# EAGLE design OSSC_HDMI_Audio_v1.3_A3 (EAGLE 7.7.0)
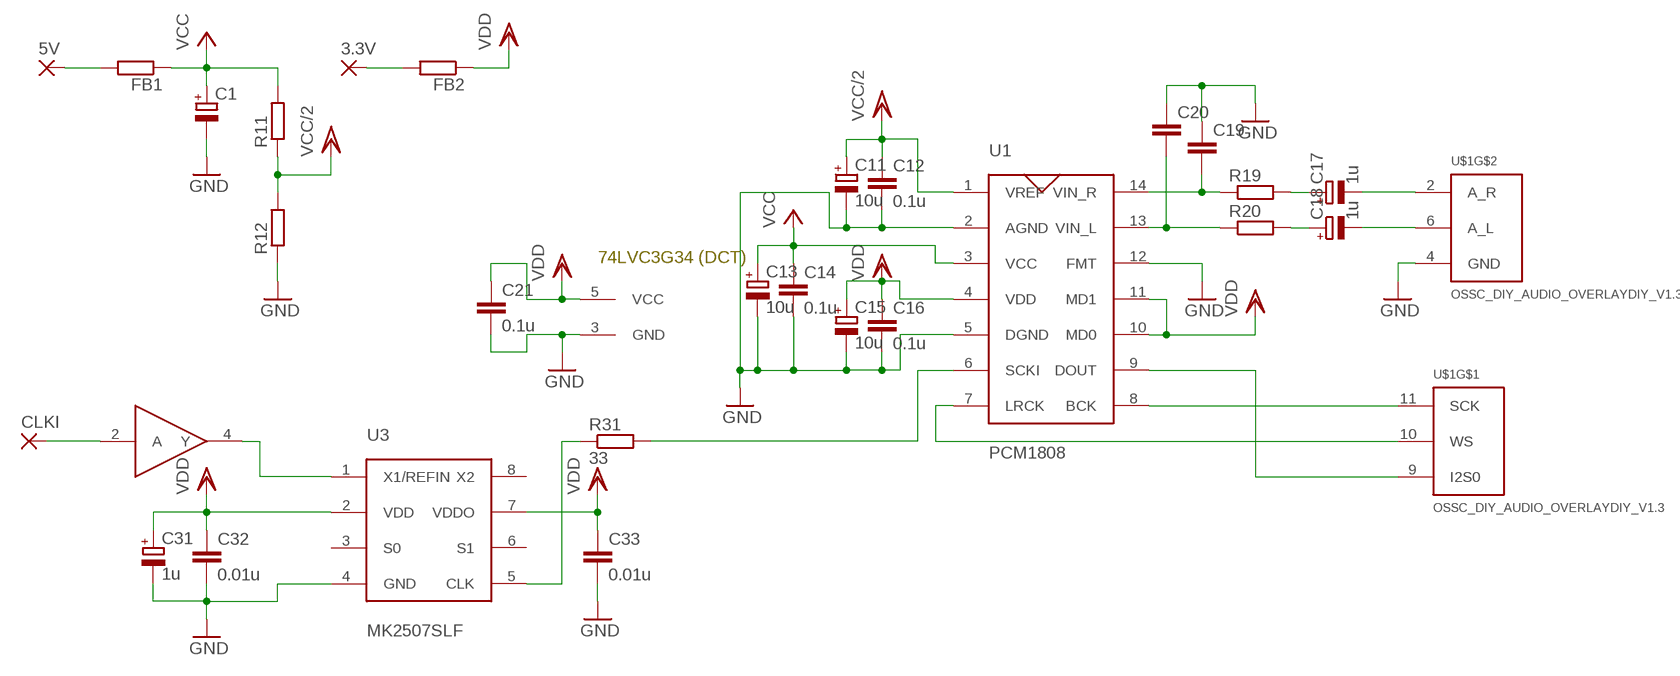
[diagram p0: schematic, sheet 1]

## Parts
3.3V  SMD2  [SMD1,27-2,54]
5V  SMD2  [SMD1,27-2,54]
C1  CPOL-EUSMCC  [SMC_C]
C11  10u  CPOL-EUSMCA  [SMC_A]
C12  0.1u  C-EUC0603  [C0603]
C13  10u  CPOL-EUSMCA  [SMC_A]
C14  0.1u  C-EUC0603  [C0603]
C15  10u  CPOL-EUSMCA  [SMC_A]
C16  0.1u  C-EUC0603  [C0603]
C17  1u  CPOL-EUSMCA  [SMC_A]
C18  1u  CPOL-EUSMCA  [SMC_A]
C19  C-EUC0603  [C0603]
C20  C-EUC0603  [C0603]
C21  0.1u  C-EUC0603  [C0603]
C31  1u  CPOL-EUSMCA  [SMC_A]
C32  0.01u  C-EUC0603  [C0603]
C33  0.01u  C-EUC0603  [C0603]
CLKI  SMD2  [SMD1,27-2,54]
FB1  R-EU_R0603  [R0603]
FB2  R-EU_R0603  [R0603]
R11  R-EU_R0603  [R0603]
R12  R-EU_R0603  [R0603]
R19  R-EU_R0603  [R0603]
R20  R-EU_R0603  [R0603]
R31  33  R-EU_R0603  [R0603]
U1  PCM1808  [PCM1808]
U2  74LVC1G34  [74LVC1G34DCK]
U3  MK2507SLF  [SOIC8]
U$1  OSSC_DIY_AUDIO_OVERLAYDIY_V1.3  [OSSC_OVERLAY_V1.3]

## Nets
GND: C1.- C11.- C12.2 C13.- C14.2 C15.- C16.2 C19.1 C20.1 C21.2 C31.- C32.2 C33.2 R12.1 U1.2(AGND) U1.5(DGND) U1.12(FMT) U2.3(GND) U3.4(GND) U$1.4(GND)
N$1: C18.- U$1.6(A_L)
N$2: C17.- U$1.2(A_R)
N$3: C17.+ R19.2
N$4: C19.2 R19.1 U1.14(VIN_R)
N$5: C20.2 R20.1 U1.13(VIN_L)
N$6: C18.+ R20.2
N$7: R31.1 U3.5(CLK)
N$8: U2.4(Y) U3.1(X1/REFIN)
N$9: CLKI.1(P) U2.2(A)
N$10: 5V.1(P) FB1.2
N$11: 3.3V.1(P) FB2.2
N$13: U1.7(LRCK) U$1.10(WS)
N$14: U1.8(BCK) U$1.11(SCK)
N$15: U1.9(DOUT) U$1.9(I2S0)
N$17: R31.2 U1.6(SCKI)
VCC: C1.+ C13.+ C14.1 FB1.1 R11.2 U1.3(VCC)
VCC/2: C11.+ C12.1 R11.1 R12.2 U1.1(VREF)
VDD: C15.+ C16.1 C21.1 C31.+ C32.1 C33.1 FB2.1 U1.4(VDD) U1.10(MD0) U1.11(MD1) U2.5(VCC) U3.2(VDD) U3.7(VDDO)
Unconnected: U3.3(S0) U3.6(S1) U3.8(X2)

## Notes on the sheet
- 74LVC3G34 (DCT)

## Library data of the parts
3.3V 5V CLKI = wirepad:SMD2: SMD PAD
C1 C11 C13 C15 C17 C18 C31 = rcl:CPOL-EU: POLARIZED CAPACITOR, European symbol
C12 C14 C16 C19-C21 C32 C33 = rcl:C-EU: CAPACITOR, European symbol
FB1 FB2 R11 R12 R19 R20 R31 = rcl:R-EU_: RESISTOR, European symbol
U1 = OSSC_HDMI_Audio:PCM1808
U2 = OSSC_HDMI_Audio:74LVC1G34
U3 = OSSC_HDMI_Audio:MK2507SLF
U$1 = OSSC_HDMI_Audio:OSSC_DIY_AUDIO_OVERLAY

## Board
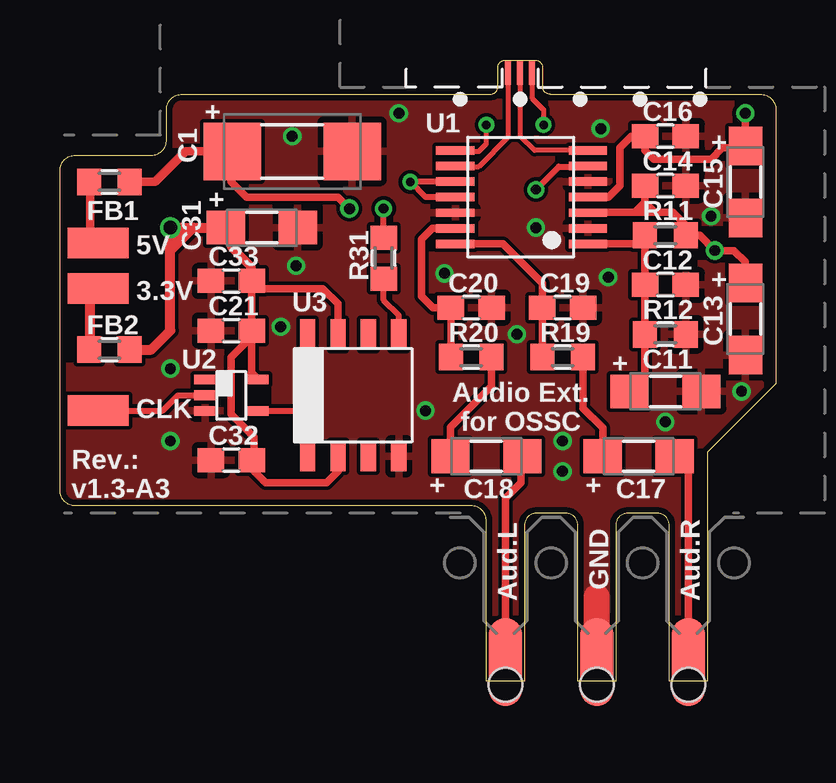
[diagram p1: board, top side]
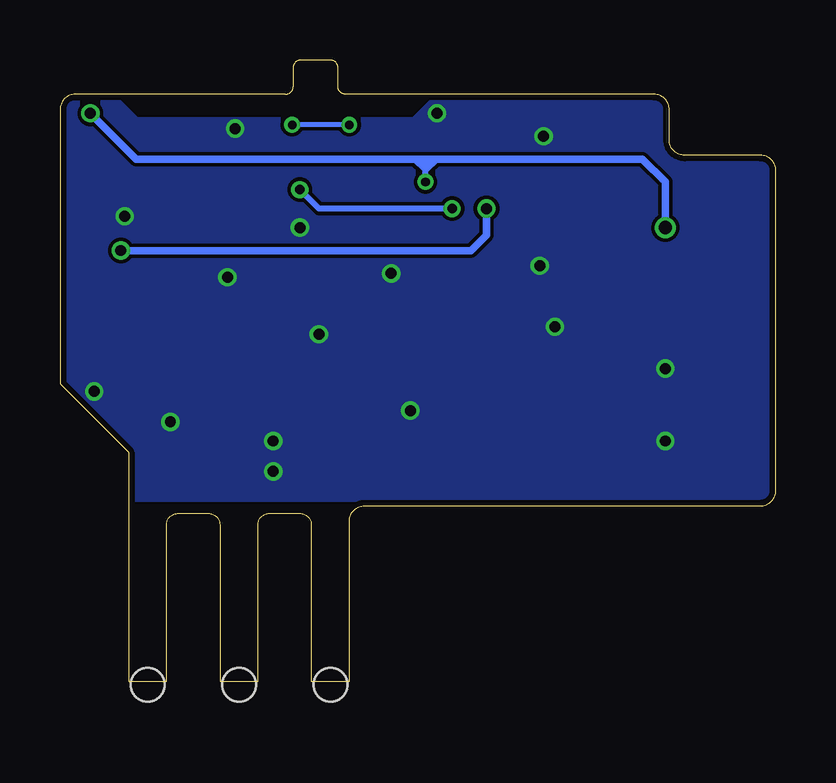
[diagram p2: board, bottom side, seen from below]

Size 29.84 x 25.88 mm. Coordinates in mm from the lower left corner, seen from the top.
Outline: 0,7.94 0,21.27 arc-90 0.64,21.91 3.81,21.91 arc90 4.45,22.54 4.45,23.81 arc-90 5.08,24.45 17.94,24.45 arc90 18.26,24.77 18.26,25.56 arc-90 18.57,25.88 19.8,25.88 arc-90 20.12,25.56 20.12,24.77 arc90 20.44,24.45 29.21,24.45 arc-90 29.84,23.81 29.84,12.38 26.99,9.53 26.99,0 25.4,0 25.4,6.51 arc90 24.92,6.99 23.65,6.99 arc90 23.18,6.51 23.18,0 21.59,0 21.59,6.51 arc90 21.11,6.99 19.84,6.99 arc90 19.37,6.51 19.37,0 17.78,0 17.78,6.67 arc90 17.14,7.3 0.64,7.3 arc-90 0,7.94
Copper layers (1*16): Top 0.035mm / dielectric 1.5mm / Bottom 0.035mm
Design rules "ITEADstudio_DRC": minimum track width 6mil, minimum drill 12mil, track to track 6mil, track to pad 6mil, pad to pad 6mil, via to via 6mil, smd to smd 0mil, copper to edge 10mil, drill to drill 10mil, minimum pad ring 10mil, minimum via ring 6mil, stop-mask expansion 2mil, vias tented up to drill 30mil, thermal gap 10mil
tRestrict: area 16.8,12.9 to 17.5,14.1; area 20.6,12.9 to 21.3,14.1; area 22.9,18.4 to 23.7,19.2; area 24.8,15.1 to 26.5,17.9; area 1.7,20.2 to 2.4,21.3; area 10.6,8.7 to 11.3,10; area 6.7,15.2 to 7.8,16; area 6.7,17.3 to 7.1,18.1; area 29.4,12.5 to 29.8,24.3; area 26.5,17.6 to 29.8,18.9; area -1,13.3 to 3.5,21.9; area 8.1,11.3 to 8.7,12.5

### Footprints (pad centres in the part's own frame; a part is rotated, then mirrored left to right if it is on the bottom)
SMD1,27-2,54 = smd 1.27 x 2.54: 1 0,0
SMC_C = smd 2.4 x 2.4: + -2.5,0; - 2.5,0
SMC_A = smd 1.6 x 1.4: + -1.5,0; - 1.5,0
C0603 = smd 1.1 x 1: 1 -0.85,0; 2 0.85,0
R0603 = smd 1 x 1.1: 1 -0.85,0; 2 0.85,0
PCM1808 = smd 1.6 x 0.35: 1 -2.8,1.95; 2 -2.8,1.3; 3 -2.8,0.65; 4 -2.8,0; 5 -2.8,-0.65; 6 -2.8,-1.3; 7 -2.8,-1.95; 8 2.725,-1.95; 9 2.725,-1.3; 10 2.725,-0.65; 11 2.725,0; 12 2.725,0.65; 13 2.725,1.3; 14 2.725,1.95
74LVC1G34DCK = smd 0.9 x 0.4: 1 -1.1,0.65; 2 -1.1,0; 3 -1.1,-0.65; 4 1.1,-0.65; 5 1.1,0.65
SOIC8 = smd 1.27 x 0.635: 1 -2.54,1.905; 2 -2.54,0.635; 3 -2.54,-0.635; 4 -2.54,-1.905; 5 2.54,-1.905; 6 2.54,-0.635; 7 2.54,0.635; 8 2.54,1.905
OSSC_OVERLAY_V1.3 = smd 1.397 x 3.683: 2 3.81,0.953; 4 0,0.953; 6 -3.81,0.953 | smd 0.246 x 1: 9 -3.7,25.5; 10 -3.2,25.5; 11 -2.7,25.5 | hole 1.4: -3.81,0; 0,0; 3.81,0

### Placement (x,y rotation side)
3.3V  1.59,16.35 270 top
5V  1.59,18.26 270 top
C1  9.68,22.07 0 top
C11  25.24,12.07 0 top
C12  25.24,16.51 0 top
C13  28.57,15.08 270 top
C14  25.24,20.64 0 top
C15  28.57,20.8 270 top
C16  25.24,22.7 0 top
C17  24.13,9.37 0 top
C18  17.78,9.37 0 top
C19  20.95,15.56 180 top
C20  17.14,15.56 180 top
C21  7.14,14.61 180 top
C31  8.41,18.89 0 top
C32  7.14,16.67 180 top
C33  7.14,9.21 180 top
CLKI  1.59,11.27 270 top
FB1  2.06,20.8 180 top
FB2  2.06,13.81 180 top
R11  25.24,18.57 0 top
R12  25.24,14.45 180 top
R19  20.95,13.49 0 top
R20  17.14,13.49 0 top
R31  13.49,17.62 90 top
U1  19.21,20.16 180 top
U2  7.14,11.91 0 top
U3  12.22,11.91 90 top
U$1  22.38,-0.16 0 top

### Tracks (layer width: path | path; a pad name or v marks a point on that pad's centre or on a via)
GND  (via drill 0.46)
  Top 1.077: 22.38,-0.16 22.38,3.49
  other vias: 20.95,10 20.95,8.73 16.03,16.99 22.86,16.83 22.54,23.02 4.6,13.02 4.6,10 9.84,17.3 19.84,18.89 15.24,11.27 14.13,23.65 19.05,14.45 27.15,19.37 25.24,10.79 28.42,12.07 9.21,14.76 9.68,22.7
  pour Top (rank 6): 0,-0.16 30.48,-0.16 30.48,24.61 0,24.61
  pour Bottom (rank 6): 0,7.62 30.48,7.62 30.48,24.61 27.94,24.61 26.67,23.34 15.08,23.34 13.81,24.61 0,24.61
N$1
  Top 0.305: U$1.6 18.57,7.62 19.21,8.26 19.21,9.45 C18.-
N$2
  Top 0.305: U$1.2 26.19,8.8 C17.-
N$3
  Top 0.305: R19.2 21.8,11.37 22.63,10.55 C17.+
N$4
  Top 0.305: R19.1 C19.2 20.11,16.57 18.46,18.21 U1.14
N$5
  Top 0.305: U1.13 15.53,18.86 15.08,18.42 15.08,16.03 15.56,15.56 C20.2 R20.1
N$6
  Top 0.305: C18.+ 16.28,10.57 18,12.28 R20.2
N$7
  Top 0.254: U3.5 14.13,15.24 13.49,15.88 R31.1
N$8
  Top 0.254: U2.4 9.86,11.26 10.32,10.8 U3.1
N$9
  Top 0.254: CLKI.1 4.29,11.27 4.92,11.91 U2.2
N$10
  Top 0.356: FB1.2 1.27,20.8 1.27,18.26 5V.1
N$11
  Top 0.406: FB2.2 1.27,13.81 1.27,16.19 1.59,16.19 3.3V.1
N$13
  Top 0.203: U1.7 19.8,22.11 19.18,22.73 U$1.10
N$14  (via drill 0.36)
  Top 0.203: v20.16,23.18 20.16,23.81 19.68,24.29 U$1.11 | v17.78,23.18 17.78,22.38 17.46,22.07 16.67,22.07 16.62,22.11 U1.8
  Bottom 0.203: v17.78,23.18 v20.16,23.18
N$15
  Top 0.203: U$1.9 18.68,22.65 17.46,21.43 16.51,21.43 U1.9
N$17  (via drill 0.41)
  Top 0.254: v19.84,20.48 20.8,21.43 21.98,21.43 U1.6 21.78,21.46 21.91,21.43 | R31.2 v13.49,19.69
  Bottom 0.254: v19.84,20.48 19.05,19.69 v13.49,19.69
VCC  (via drill 0.46)
  Top 0.305: 24.39,19.95 23.97,19.53 | U1.3 22.02,19.53 23.97,19.53 | 24.39,19.95 24.81,19.53 | 24.61,19.53 23.97,19.53 | 24.81,19.53 24.61,19.53 | 24.61,19.53 24.45,19.69 | 24.81,19.53 25.56,19.53 26.04,19.05 26.04,18.68 R11.2 | 24.39,19.95 C14.1 | v12.06,19.69 11.59,20.16 7.78,20.16 7.14,20.8 7.14,22.03 C1.+ | R11.2 26.09,18.52 | R11.2 26.67,18.57 v27.3,17.94 28.1,17.94 28.57,17.46 C13.+
  Top 0.356: FB1.1 3.97,20.8 5.24,22.07 C1.+
  Bottom 0.305: v12.06,19.69 12.06,18.57 12.7,17.94 v27.3,17.94
VCC/2
  Top 0.305: U1.1 24.03,18.21 R11.1 C12.1 R12.2 24.39,12.08 C11.+
VDD  (via drill 0.36, 0.46, 0.56)
  Top 0.254: 28.5,22.23 C15.+ | U1.11 15.24,20.16 v14.61,20.8 16.51,20.8 16.5,20.81 U1.10
  Top 0.305: 8.1,9.37 8.1,8.73 8.57,8.26 11.11,8.26 11.59,8.73 U3.2 | U1.4 22.86,20.16 23.34,20.64 23.34,22.23 23.81,22.7 C16.1 24.39,22.12 24.77,21.75 27.15,21.75 27.62,22.23 28.5,22.23 | U3.7 11.59,15.72 10.95,16.35 8.31,16.35 C32.1 C21.1 | C33.1 8.1,9.37 | 8.1,9.37 8.1,10.16 7.14,11.11 7.14,13.49 7.99,14.34 C21.1 | 7.99,12.81 C21.1 | C15.+ v28.57,23.65
  Top 0.356: 7.99,12.81 U2.5 | C32.1 7.99,17.25 7.14,18.1 7.14,18.66 C31.+
  Top 0.406: FB2.1 3.81,13.81 4.6,14.61 4.6,17.94 | 4.6,18.42 v4.6,18.89 5.08,18.89 | 5.08,18.89 5.56,18.89 | 5.56,18.89 4.6,17.94 | 4.6,17.94 4.6,18.42 | 4.6,18.42 5.08,18.89 | 5.56,18.89 C31.+
  Bottom 0.254: v14.61,20.8 14.61,21.27 | 14.76,21.75 14.61,21.75 14.61,21.43 | 14.76,21.75 15.08,21.75 14.61,21.27 | 14.61,21.43 14.76,21.59 14.76,21.75 | 14.61,21.27 14.13,21.75 14.45,21.75 14.45,21.59 14.61,21.43 | 14.61,21.27 14.61,21.43
  Bottom 0.305: v28.57,23.65 26.67,21.75 14.61,21.75 14.45,21.75 5.56,21.75 4.6,20.8 v4.6,18.89

### Text on the board
tPlace: + | + | + | + | + | Audio Ext. / for OSSC | + | +
tNames: U1 | C16 | C1 | C14 | C15 | FB1 | R11 | 5V | C31 | C33 | R31 | C12 | 3.3V | U3 | C20 | C19 | FB2 | C21 | R12 | R20 | R19 | C13 | U2 | C11 | CLK | C32 | Rev.: / v1.3-A3 | C18 | C17 | GND | Aud.L | Aud.R